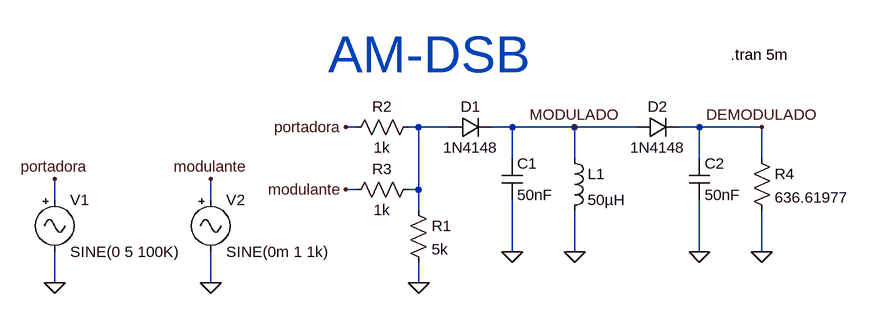
[diagram p0: schematic MOD-AM-DSB.asc]
MOD-AM-DSB.asc, the LTspice schematic file:
Version 4
SHEET 1 1780 748
WIRE 352 -144 336 -144
WIRE 448 -144 432 -144
WIRE 496 -144 448 -144
WIRE 592 -144 560 -144
WIRE 688 -144 592 -144
WIRE 784 -144 688 -144
WIRE 880 -144 848 -144
WIRE 976 -144 880 -144
WIRE 592 -96 592 -144
WIRE 688 -96 688 -144
WIRE 880 -96 880 -144
WIRE 976 -96 976 -144
WIRE 352 -48 336 -48
WIRE 448 -48 448 -144
WIRE 448 -48 432 -48
WIRE -112 -32 -112 -64
WIRE 128 -32 128 -64
WIRE 448 -16 448 -48
WIRE 592 48 592 -32
WIRE 688 48 688 -16
WIRE 880 48 880 -32
WIRE 976 48 976 -16
WIRE -112 96 -112 48
WIRE 128 96 128 48
WIRE 448 96 448 64
FLAG 448 96 0
FLAG 592 48 0
FLAG 688 48 0
FLAG 336 -48 modulante
FLAG 336 -144 portadora
FLAG -112 -64 portadora
FLAG 128 -64 modulante
FLAG 128 96 0
FLAG -112 96 0
FLAG 976 -144 DEMODULADO
FLAG 688 -144 MODULADO
FLAG 880 48 0
FLAG 976 48 0
SYMBOL res 432 -32 R0
SYMATTR InstName R1
SYMATTR Value 5k
SYMBOL res 336 -128 R270
WINDOW 0 32 56 VTop 2
WINDOW 3 0 56 VBottom 2
SYMATTR InstName R2
SYMATTR Value 1k
SYMBOL res 336 -32 R270
WINDOW 0 32 56 VTop 2
WINDOW 3 0 56 VBottom 2
SYMATTR InstName R3
SYMATTR Value 1k
SYMBOL diode 496 -128 R270
WINDOW 0 32 32 VTop 2
WINDOW 3 0 32 VBottom 2
SYMATTR InstName D1
SYMATTR Value 1N4148
SYMBOL cap 576 -96 R0
SYMATTR InstName C1
SYMATTR Value 50nF
SYMBOL ind 672 -112 R0
SYMATTR InstName L1
SYMATTR Value 50µH
SYMBOL Misc\\signal -112 -48 R0
WINDOW 123 0 0 Left 2
WINDOW 39 0 0 Left 2
SYMATTR InstName V1
SYMATTR Value SINE(0 5 100K)
SYMBOL Misc\\signal 128 -48 R0
WINDOW 123 0 0 Left 2
WINDOW 39 0 0 Left 2
SYMATTR InstName V2
SYMATTR Value SINE(0m 1 1k)
SYMBOL cap 864 -96 R0
SYMATTR InstName C2
SYMATTR Value 50nF
SYMBOL res 960 -112 R0
SYMATTR InstName R4
SYMATTR Value 636.61977
SYMBOL diode 784 -128 R270
WINDOW 0 32 32 VTop 2
WINDOW 3 0 32 VBottom 2
SYMATTR InstName D2
SYMATTR Value 1N4148
TEXT 928 -256 Left 2 !.tran 5m
TEXT 464 -256 Center 6 ;AM-DSB

The netlist it stands for:
* MOD-AM-DSB.asc
R1 N001 0 5k
R2 portadora N001 1k
R3 modulante N001 1k
D1 N001 MODULADO 1N4148
C1 MODULADO 0 50nF
L1 MODULADO 0 50µH
V1 portadora 0 SINE(0 5 100K)
V2 modulante 0 SINE(0m 1 1k)
C2 DEMODULADO 0 50nF
R4 DEMODULADO 0 636.61977
D2 MODULADO DEMODULADO 1N4148
.model D D
.lib standard.dio
.tran 5m
* AM-DSB
.backanno
.end